# Altium schematic sheet alimentacion.SchDoc
size A4
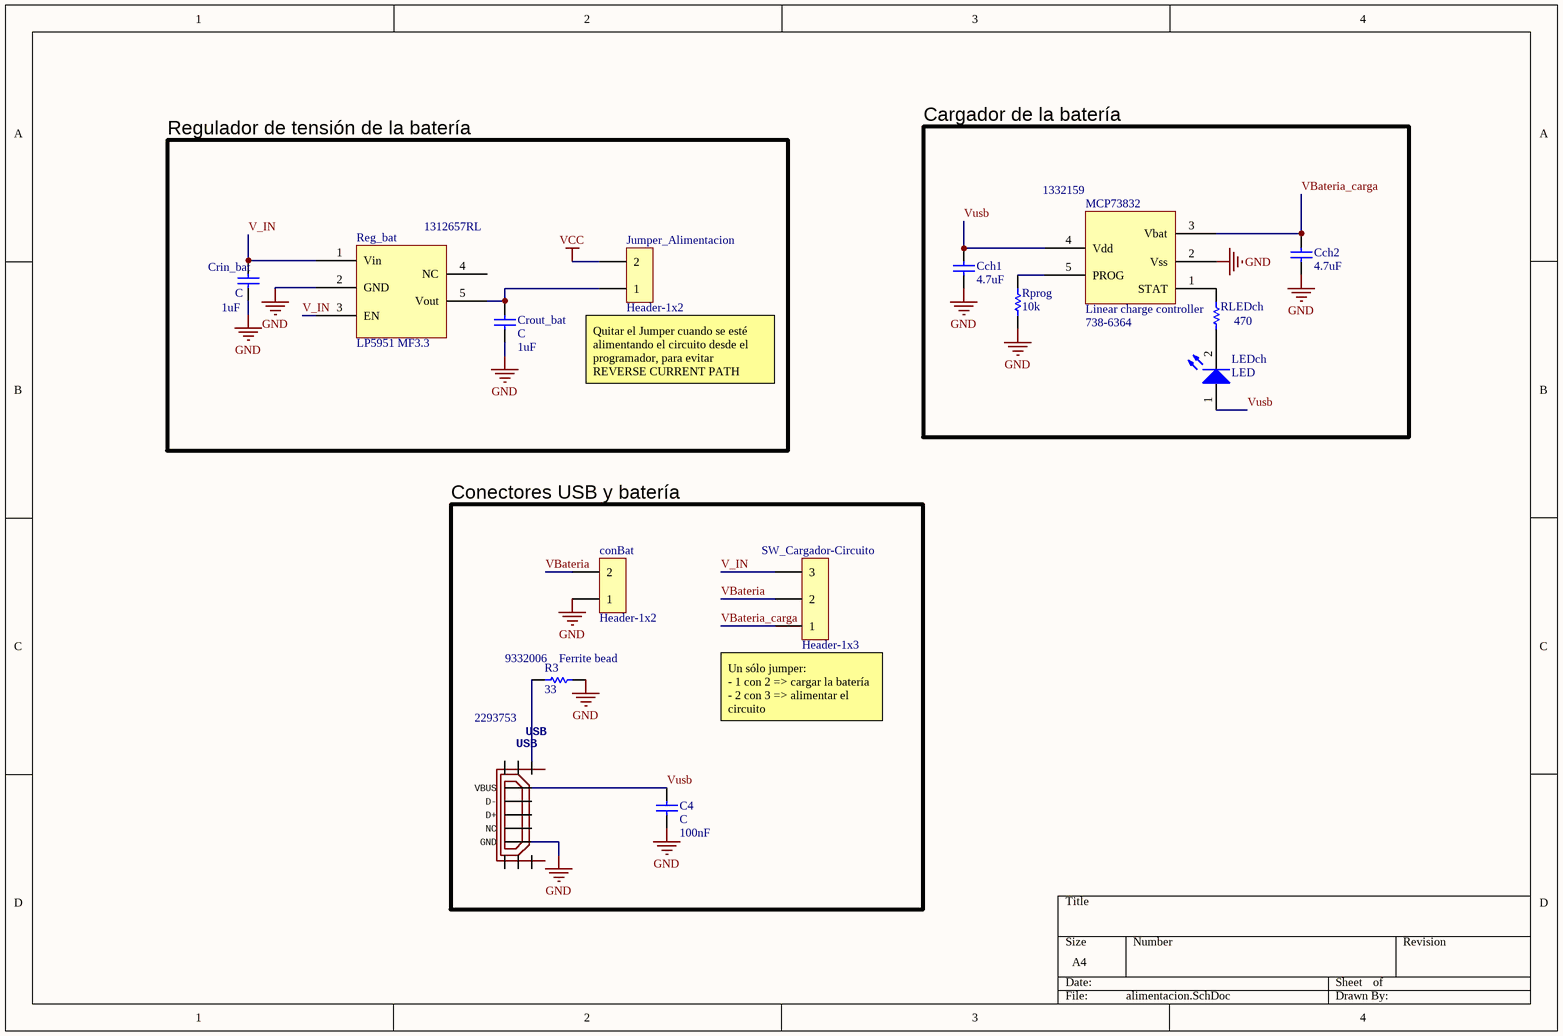
[diagram p0: alimentacion.SchDoc]

## Parts
C4  C  value 100nF  [0805 CAP]
Cch1  value 4.7uF  [0805]  (hidden comment: C)
Cch2  value 4.7uF  [0805]  (hidden comment: C)
conBat  Header-1x2  [HEADER-1x2]
Crin_bat  C  value 1uF  [0805]
Crout_bat  C  value 1uF  [0805]
Jumper_Alimentacion  Header-1x2  [HEADER-1x2]
LEDch  LED  [0603 LED-RED]
MCP73832  Linear charge controller  Supplier Part Number 1: 738-6364  Supplier Part Number 2: 1332159  [SOT-23-5]
R3  Ferrite bead  value 33  Supplier Part Number 1: 9332006  [0805]
Reg_bat  LP5951 MF3.3  Supplier Part Number 1: 1312657RL  [SOT-23-5]
RLEDch  value 470  [0805]  (hidden comment: Res1)
Rprog  value 10k  [0805]  (hidden comment: Res1)
SW_Cargador-Circuito  Header-1x3  [Header-1x3-Jumper]
USB  USB  Supplier Part Number 1: 2293753  [HIROSE-ZX62R-B-5P]

## Blocks framed on the sheet
Cargador de la batería: Cch1 Cch2 LEDch MCP73832 RLEDch Rprog
Regulador de tensión de la batería: Crin_bat Crout_bat Jumper_Alimentacion Reg_bat
Conectores USB y batería: C4 conBat R3 SW_Cargador-Circuito USB

## Nets
GND: C4.1 Cch1.1 Cch2.1 conBat.1 Crin_bat.1 Crout_bat.1 MCP73832.2(Vss) R3.1 Reg_bat.2(GND) Rprog.2 USB.GND
VCC: Jumper_Alimentacion.2
V_IN: Crin_bat.2 Reg_bat.1(Vin) Reg_bat.3(EN) SW_Cargador-Circuito.3
VBateria: conBat.2 SW_Cargador-Circuito.2
VBateria_carga: Cch2.2 MCP73832.3(Vbat) SW_Cargador-Circuito.1
Vusb: C4.2 Cch1.2 LEDch.1(A) MCP73832.4(Vdd) USB.VBUS
NetCrout_bat_2: Crout_bat.2 Jumper_Alimentacion.1 Reg_bat.5(Vout)
NetLEDch_2: LEDch.2(C) RLEDch.1
NetMCP73832_1: MCP73832.1(STAT) RLEDch.2
NetMCP73832_5: MCP73832.5(PROG) Rprog.1
NetR3_2: R3.2 USB.SHIELD4

Not connected (* = marked no-connect by the designer): Reg_bat 4(NC); USB D+ D- NC SHIELD1 SHIELD2 SHIELD3 SHIELD5 SHIELD6

## Notes on the sheet
- (near Jumper_Alimentacion) Quitar el Jumper cuando se esté alimentando el circuito desde el programador, para evitar REVERSE CURRENT PATH
- (near SW_Cargador-Circuito) Un sólo jumper:
  - 1 con 2 => cargar la batería
  - 2 con 3 => alimentar el circuito

## Library data of the parts
C4 Cch1 Cch2 Crin_bat Crout_bat = C: Capacitor; Manufacturer: Generic Components; Class: Passive; Published: 08/06/2000; Publisher: Altium Hobart Technology Centre; SubClass: Capacitor
MCP73832 = MCP73832: Linear charge controller SOT 235; Supplier 1: RS-Components; Supplier 2: Farnell
R3 = R: Resistor; Manufacturer: Generic Components; Class: Passive; Published: 08/06/2000; Publisher: Altium Hobart Technology Centre; SubClass: Resistor; Supplier 1: Farnell
Reg_bat = LP5951: TI Lineal Regulator SOT 235; Supplier 1: Farnell
RLEDch Rprog = Res1: Resistor; Published: 8-Jun-2000; LatestRevisionDate: 17-Jul-2002; LatestRevisionNote: Re-released for DXP Platform.; PackageReference: AXIAL-0.3; Publisher: Altium Limited; PackageDescription: Axial Device, Thru-Hole; 2 Leads; 0.3 in Pin Spacing
  Rprog: Supplier 1: Farnell
USB = USB_MICRO_FLIPPED: Supplier 1: Farnell